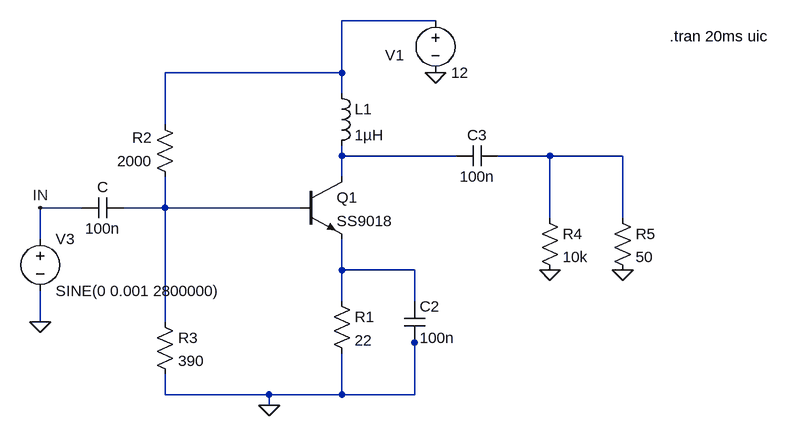
[diagram p0: schematic antenna-amplfier.asc]
antenna-amplfier.asc, the LTspice schematic file:
Version 4
SHEET 1 2344 2032
WIRE 1168 1072 1024 1072
WIRE 1024 1152 1024 1072
WIRE 1024 1152 752 1152
WIRE 1024 1184 1024 1152
WIRE 752 1232 752 1152
WIRE 1024 1280 1024 1264
WIRE 1200 1280 1024 1280
WIRE 1344 1280 1264 1280
WIRE 1456 1280 1344 1280
WIRE 1024 1312 1024 1280
WIRE 624 1360 560 1360
WIRE 752 1360 752 1312
WIRE 752 1360 688 1360
WIRE 960 1360 752 1360
WIRE 1344 1376 1344 1280
WIRE 1456 1376 1456 1280
WIRE 560 1408 560 1360
WIRE 1024 1456 1024 1408
WIRE 1136 1456 1024 1456
WIRE 1024 1504 1024 1456
WIRE 1136 1504 1136 1456
WIRE 560 1536 560 1488
WIRE 752 1536 752 1360
WIRE 1136 1568 1136 1552
WIRE 752 1648 752 1616
WIRE 912 1648 752 1648
WIRE 1024 1648 1024 1584
WIRE 1024 1648 912 1648
WIRE 1136 1648 1136 1568
WIRE 1136 1648 1024 1648
WIRE 912 1664 912 1648
FLAG 560 1536 0
FLAG 560 1360 IN
FLAG 912 1664 0
FLAG 1168 1152 0
FLAG 1344 1456 0
FLAG 1456 1456 0
SYMBOL voltage 560 1392 R0
WINDOW 123 0 0 Left 0
WINDOW 39 0 0 Left 0
SYMATTR InstName V3
SYMATTR Value SINE(0 0.001 2800000)
SYMBOL cap 688 1344 R90
WINDOW 0 0 32 VBottom 2
WINDOW 3 32 32 VTop 2
SYMATTR InstName C
SYMATTR Value 100n
SYMBOL res 768 1328 R180
WINDOW 0 36 76 Left 2
WINDOW 3 36 40 Left 2
SYMATTR InstName R2
SYMATTR Value 2000
SYMBOL res 736 1520 R0
SYMATTR InstName R3
SYMATTR Value 390
SYMBOL npn2 960 1312 R0
SYMATTR InstName Q1
SYMATTR Value SS9018
SYMBOL VOLTAGE 1168 1056 R0
WINDOW 0 -77 69 Left 2
WINDOW 123 0 0 Left 0
WINDOW 39 0 0 Left 0
SYMATTR InstName V1
SYMATTR Value 12
SYMBOL res 1008 1488 R0
SYMATTR InstName R1
SYMATTR Value 22
SYMBOL cap 1120 1504 R0
SYMATTR InstName C2
SYMATTR Value 100n
SYMBOL cap 1264 1264 R90
WINDOW 0 0 32 VBottom 2
WINDOW 3 32 32 VTop 2
SYMATTR InstName C3
SYMATTR Value 100n
SYMBOL ind 1008 1168 R0
SYMATTR InstName L1
SYMATTR Value 1µH
SYMBOL res 1328 1360 R0
SYMATTR InstName R4
SYMATTR Value 10k
SYMBOL res 1440 1360 R0
SYMATTR InstName R5
SYMATTR Value 50
TEXT 1528 1096 Left 2 !.tran 20ms uic

The netlist it stands for:
* antenna-amplfier.asc
V3 IN 0 SINE(0 0.001 2800000)
C N004 IN 100n
R2 N004 N001 2000
R3 N004 0 390
Q1 N002 N004 N005 0 SS9018
V1 N001 0 12
R1 N005 0 22
C2 N005 0 100n
C3 N003 N002 100n
L1 N001 N002 1µH
R4 N003 0 10k
R5 N003 0 50
.model NPN NPN
.model PNP PNP
.lib standard.bjt
.tran 20ms uic
.backanno
.end